# Altium schematic sheet PIC_MAIN.SchDoc
size A3; ApprovedBy: D. Grossman; CheckedBy: G. Engel; Author: Y. Yakov; CompanyName: LightSense; DrawnBy: Y. Yakov; Engineer: Y.Yakov; Organization: LightSense
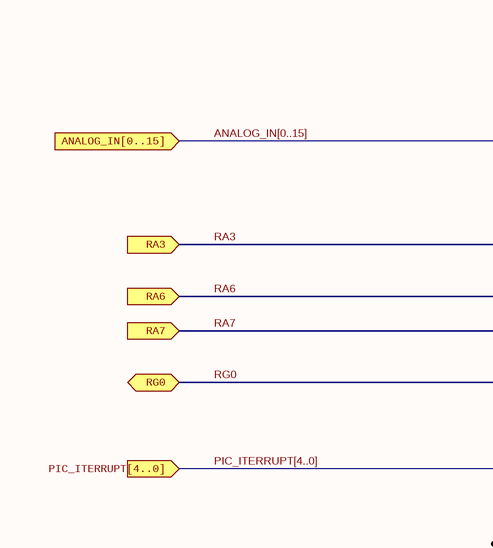
[diagram p0: PIC_MAIN.SchDoc, top left]
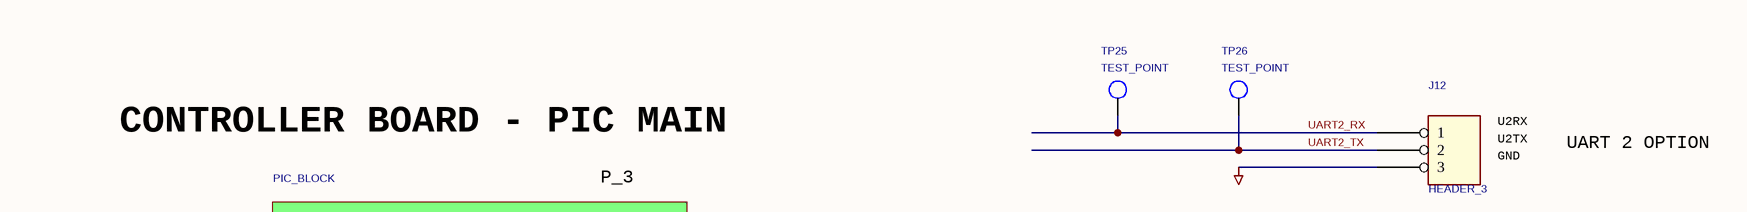
[diagram p1: PIC_MAIN.SchDoc, top right]
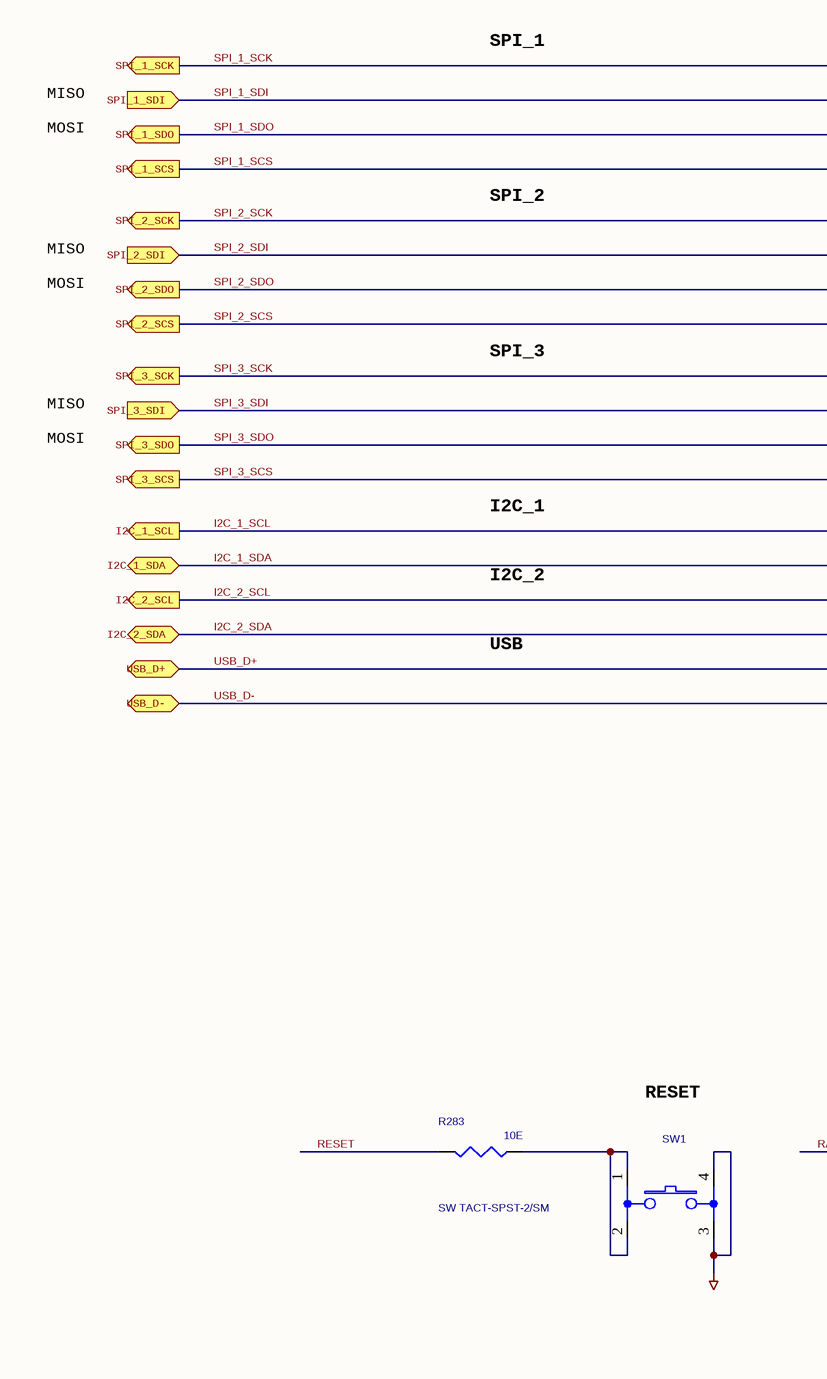
[diagram p2: PIC_MAIN.SchDoc, bottom left]
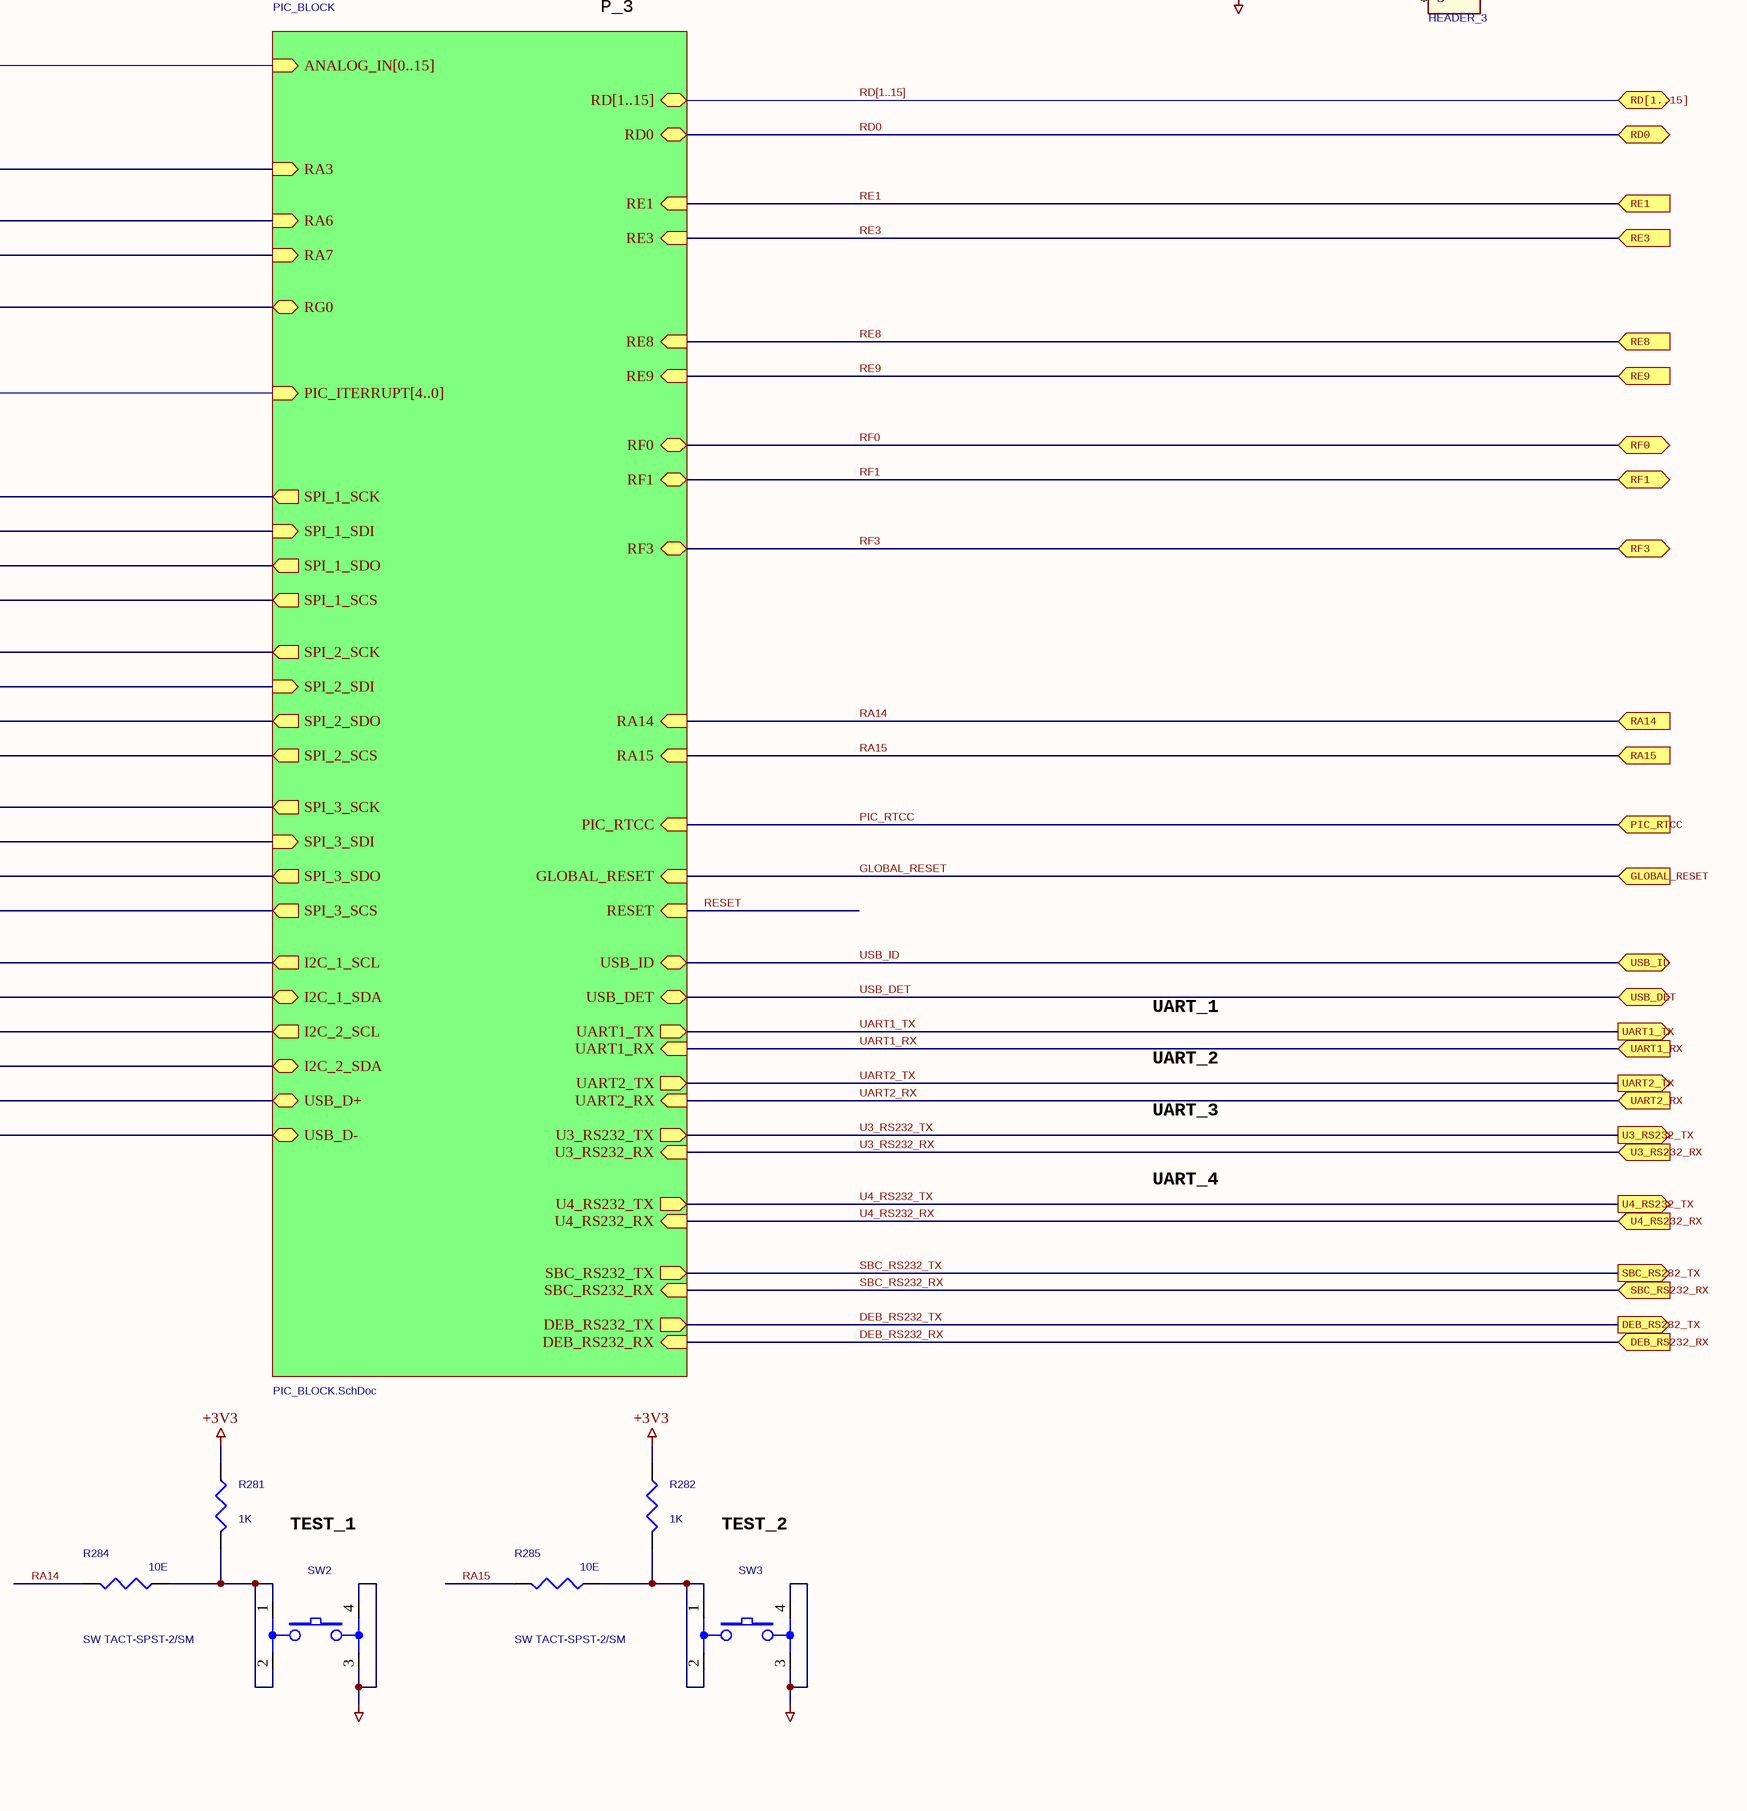
[diagram p3: PIC_MAIN.SchDoc, bottom right]

## Parts
J12  HEADER_3  [TH_3pin_100mil]
R281  1K  [0603]
R282  1K  [0603]
R283  10E  [0603]
R284  10E  [0603]
R285  10E  [0603]
SW1  SW TACT-SPST-2/SM  [SMT_4PIN]
SW2  SW TACT-SPST-2/SM  [SMT_4PIN]
SW3  SW TACT-SPST-2/SM  [SMT_4PIN]
TP25  TEST_POINT  [TH_1mm]
TP26  TEST_POINT  [TH_1mm]

## Sub-sheets
PIC_BLOCK = PIC_BLOCK.SchDoc: GLOBAL_RESET (in), ANALOG_IN[0..15] (in), RESET (in), I2C_2_SDA (bidir), I2C_1_SDA (bidir), I2C_2_SCL (out), I2C_1_SCL (out), SPI_3_SDO (out), SPI_3_SCS (out), SPI_3_SDI (in), SPI_3_SCK (out), SPI_2_SCS (out), SPI_2_SDO (out), SPI_2_SDI (in), SPI_2_SCK (out), SBC_RS232_TX (out), SBC_RS232_RX (in), DEB_RS232_TX (out), DEB_RS232_RX (in), PIC_ITERRUPT[4..0] (in), RD[1..15] (bidir), RD0 (bidir), RF0 (bidir), RF1 (bidir), RF3 (bidir), USB_DET (bidir), U4_RS232_RX (in), U4_RS232_TX (out), U3_RS232_TX (out), U3_RS232_RX (in), USB_D+ (bidir), USB_D- (bidir), RE1 (in), RE3 (in), RE8 (in), RE9 (in), USB_ID (bidir), RA3 (in), RA14 (in), RA15 (in), UART1_RX (in), UART2_RX (in), UART1_TX (out), UART2_TX (out), RA6 (in), RA7 (in), SPI_1_SCS (out), SPI_1_SDO (out), SPI_1_SDI (in), SPI_1_SCK (out), PIC_RTCC (in), RG0 (bidir)

## Ports
ANALOG_IN[0..15] (in), DEB_RS232_RX (in), DEB_RS232_TX (out), GLOBAL_RESET (in), I2C_1_SCL (out), I2C_1_SDA (bidir), I2C_2_SCL (out), I2C_2_SDA (bidir), PIC_ITERRUPT[4..0] (in), PIC_RTCC (in), RA3 (in), RA6 (in), RA7 (in), RA14 (in), RA15 (in), RD0 (bidir), RD[1..15] (bidir), RE1 (in), RE3 (in), RE8 (in), RE9 (in), RF0 (bidir), RF1 (bidir), RF3 (bidir), RG0 (bidir), SBC_RS232_RX (in), SBC_RS232_TX (out), SPI_1_SCK (out), SPI_1_SCS (out), SPI_1_SDI (in), SPI_1_SDO (out), SPI_2_SCK (out), SPI_2_SCS (out), SPI_2_SDI (in), SPI_2_SDO (out), SPI_3_SCK (out), SPI_3_SCS (out), SPI_3_SDI (in), SPI_3_SDO (out), U3_RS232_RX (in), U3_RS232_TX (out), U4_RS232_RX (in), U4_RS232_TX (out), UART1_RX (in), UART1_TX (out), UART2_RX (in), UART2_TX (out), USB_D+ (bidir), USB_D- (bidir), USB_DET (bidir), USB_ID (bidir)

## Nets
+3V3: R281.1 R282.1
GND_CPU: J12.3 SW1.3 SW1.4 SW2.3 SW2.4 SW3.3 SW3.4
DEB_RS232_RX: port DEB_RS232_RX, sheet PIC_BLOCK/DEB_RS232_RX
DEB_RS232_TX: port DEB_RS232_TX, sheet PIC_BLOCK/DEB_RS232_TX
GLOBAL_RESET: port GLOBAL_RESET, sheet PIC_BLOCK/GLOBAL_RESET
I2C_1_SCL: port I2C_1_SCL, sheet PIC_BLOCK/I2C_1_SCL
I2C_1_SDA: port I2C_1_SDA, sheet PIC_BLOCK/I2C_1_SDA
I2C_2_SCL: port I2C_2_SCL, sheet PIC_BLOCK/I2C_2_SCL
I2C_2_SDA: port I2C_2_SDA, sheet PIC_BLOCK/I2C_2_SDA
PIC_RTCC: port PIC_RTCC, sheet PIC_BLOCK/PIC_RTCC
RA3: port RA3, sheet PIC_BLOCK/RA3
RA6: port RA6, sheet PIC_BLOCK/RA6
RA7: port RA7, sheet PIC_BLOCK/RA7
RA14: R284.2 ; port RA14, sheet PIC_BLOCK/RA14
RA15: R285.2 ; port RA15, sheet PIC_BLOCK/RA15
RD0: port RD0, sheet PIC_BLOCK/RD0
RE1: port RE1, sheet PIC_BLOCK/RE1
RE3: port RE3, sheet PIC_BLOCK/RE3
RE8: port RE8, sheet PIC_BLOCK/RE8
RE9: port RE9, sheet PIC_BLOCK/RE9
RESET: R283.2 ; sheet PIC_BLOCK/RESET
RF0: port RF0, sheet PIC_BLOCK/RF0
RF1: port RF1, sheet PIC_BLOCK/RF1
RF3: port RF3, sheet PIC_BLOCK/RF3
RG0: port RG0, sheet PIC_BLOCK/RG0
SBC_RS232_RX: port SBC_RS232_RX, sheet PIC_BLOCK/SBC_RS232_RX
SBC_RS232_TX: port SBC_RS232_TX, sheet PIC_BLOCK/SBC_RS232_TX
SPI_1_SCK: port SPI_1_SCK, sheet PIC_BLOCK/SPI_1_SCK
SPI_1_SCS: port SPI_1_SCS, sheet PIC_BLOCK/SPI_1_SCS
SPI_1_SDI: port SPI_1_SDI, sheet PIC_BLOCK/SPI_1_SDI
SPI_1_SDO: port SPI_1_SDO, sheet PIC_BLOCK/SPI_1_SDO
SPI_2_SCK: port SPI_2_SCK, sheet PIC_BLOCK/SPI_2_SCK
SPI_2_SCS: port SPI_2_SCS, sheet PIC_BLOCK/SPI_2_SCS
SPI_2_SDI: port SPI_2_SDI, sheet PIC_BLOCK/SPI_2_SDI
SPI_2_SDO: port SPI_2_SDO, sheet PIC_BLOCK/SPI_2_SDO
SPI_3_SCK: port SPI_3_SCK, sheet PIC_BLOCK/SPI_3_SCK
SPI_3_SCS: port SPI_3_SCS, sheet PIC_BLOCK/SPI_3_SCS
SPI_3_SDI: port SPI_3_SDI, sheet PIC_BLOCK/SPI_3_SDI
SPI_3_SDO: port SPI_3_SDO, sheet PIC_BLOCK/SPI_3_SDO
U3_RS232_RX: port U3_RS232_RX, sheet PIC_BLOCK/U3_RS232_RX
U3_RS232_TX: port U3_RS232_TX, sheet PIC_BLOCK/U3_RS232_TX
U4_RS232_RX: port U4_RS232_RX, sheet PIC_BLOCK/U4_RS232_RX
U4_RS232_TX: port U4_RS232_TX, sheet PIC_BLOCK/U4_RS232_TX
UART1_RX: port UART1_RX, sheet PIC_BLOCK/UART1_RX
UART1_TX: port UART1_TX, sheet PIC_BLOCK/UART1_TX
UART2_RX: J12.1 TP25.1(TP) ; port UART2_RX, sheet PIC_BLOCK/UART2_RX
UART2_TX: J12.2 TP26.1(TP) ; port UART2_TX, sheet PIC_BLOCK/UART2_TX
USB_D+: port USB_D+, sheet PIC_BLOCK/USB_D+
USB_D-: port USB_D-, sheet PIC_BLOCK/USB_D-
USB_DET: port USB_DET, sheet PIC_BLOCK/USB_DET
USB_ID: port USB_ID, sheet PIC_BLOCK/USB_ID
NetR281_2: R281.2 R284.1 SW2.1 SW2.2
NetR282_2: R282.2 R285.1 SW3.1 SW3.2
NetR283_1: R283.1 SW1.1 SW1.2

## Buses and harness runs
bus ANALOG_IN[0..15] = port ANALOG_IN[0..15] = sheet PIC_BLOCK/ANALOG_IN[0..15]
bus PIC_ITERRUPT[4..0] = port PIC_ITERRUPT[4..0] = sheet PIC_BLOCK/PIC_ITERRUPT[4..0]
bus RD[1..15] = port RD[1..15] = sheet PIC_BLOCK/RD[1..15]

## Notes on the sheet
- CONTROLLER BOARD - PIC MAIN
- U2TX
- U2RX
- UART 2 OPTION
- P_3
- GND
- SPI_1
- MOSI
- MISO
- SPI_2
- SPI_3
- I2C_2
- I2C_1
- UART_1
- USB
- UART_2
- UART_3
- UART_4
- RESET
- TEST_1
- TEST_2
- Name
- Signature
- Date
- File:
- Board Name:
- Description:
- Document Version:
- Sheet
- of
- Approved
- Reviewed
- Designed
- This drawing and any accompanying documents contain confidential information intended for a specific individual and purpose.
  This information, owned by Lightsense, is private and confidential. If you are not the intended recipient, you are hereby notified that any disclosure, copying or distribution, or the taking of any action based on the contents of this information, is strictly prohibited.

## Library data of the parts
J12 = HEADER 3
R281 R282 = R_Dup1: MFG: YAGEO; MFG_PN: RC0603FR-071K00L
R283-R285 = R_Dup1: MFG_PN: RC0603FR-0710R0L; MFG: YAGEO
TP25 TP26 = T POINT R_Dup1